# Altium schematic sheet Sheet1.SchDoc
size 420 x 297 mm; SheetNumber: 1; SheetTotal: 1
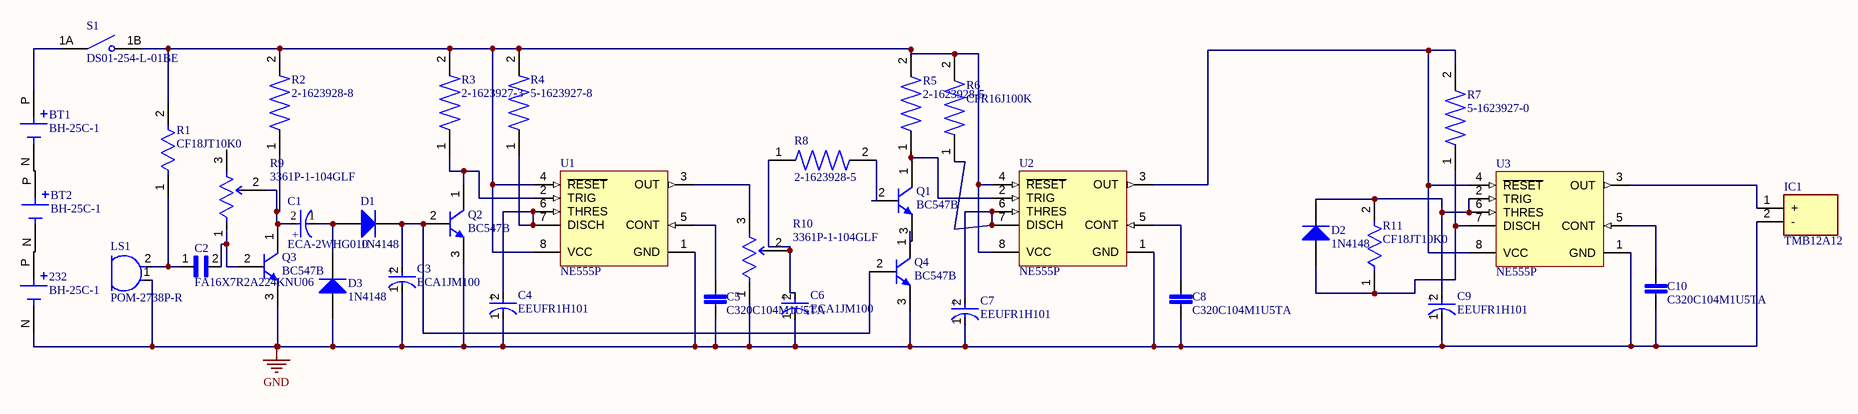
[diagram p0: Sheet1.SchDoc]

## Parts
232  BH-25C-1  [BAT_BH-25C-1]
BT1  BH-25C-1  [BAT_BH-25C-1]
BT2  BH-25C-1  [BAT_BH-25C-1]
C1  ECA-2WHG010  [FP-ECA-2WHG010-MFG]
C2  FA16X7R2A224KNU06  [CAPRB250W50L550T350H600]
C3  ECA1JM100  [FP-RAD-TH-D_5_0_5-L_11_1-MFG]
C4  EEUFR1H101  [FP-RAD-TH-D_8_0_5-L_11_5-MFG]
C5  C320C104M1U5TA  [LEADED_DECOUPLING_CAP(.1)]
C6  ECA1JM100  [FP-RAD-TH-D_5_0_5-L_11_1-MFG]
C7  EEUFR1H101  [FP-RAD-TH-D_8_0_5-L_11_5-MFG]
C8  C320C104M1U5TA  [LEADED_DECOUPLING_CAP(.1)]
C9  EEUFR1H101  [FP-RAD-TH-D_8_0_5-L_11_5-MFG]
C10  C320C104M1U5TA  [LEADED_DECOUPLING_CAP(.1)]
D1  1N4148  [NXP-SOD27-2_V]
D2  1N4148  [NXP-SOD27-2_V]
D3  1N4148  [NXP-SOD27-2_V]
IC1  TMB12A12  [TMB12A12]
LS1  POM-2738P-R  [FP-POM-2738P-R-MFG]
Q1  BC547B  [ONSC-TO-92-3-29-11]
Q2  BC547B  [ONSC-TO-92-3-29-11]
Q3  BC547B  [ONSC-TO-92-3-29-11]
Q4  BC547B  [ONSC-TO-92-3-29-11]
R1  CF18JT10K0  [FP-CF18-MFG]
R2  2-1623928-8  [RESAD700W45L350D185]
R3  2-1623927-3  [RESAD700W45L350D185]
R4  5-1623927-8  [RESAD700W45L350D185]
R5  2-1623928-5  [RESAD700W45L350D185]
R6  CFR16J100K  [RESAD700W45L350D185]
R7  5-1623927-0  [RESAD700W45L350D185]
R8  2-1623928-5  [RESAD700W45L350D185]
R9  3361P-1-104GLF  [FP-3361P-MFG]
R10  3361P-1-104GLF  [FP-3361P-MFG]
R11  CF18JT10K0  [FP-CF18-MFG]
S1  DS01-254-L-01BE  [SW_DS01-254-L-01BE]
U1  NE555P  [P0008A]
U2  NE555P  [P0008A]
U3  NE555P  [P0008A]

## Nets
GND: 232.N C3.1(C) C4.1(C) C5.2 C6.1(C) C7.1(C) C8.2 C9.1(C) C10.2 D3.1(A) IC1.2(-) LS1.1(A) Q2.3(E) Q3.3(E) Q4.3(E) R10.1(CCW) U1.1(GND) U2.1(GND) U3.1(GND)
Net232_P: 232.P BT2.N
NetBT1_N: BT1.N BT2.P
NetBT1_P: BT1.P S1.1A(COM1)
NetC1_1: C1.1(C) D1.1(A) D3.2(K)
NetC1_2: C1.2(A) Q3.1(C) R2.1 R9.2(WIPER)
NetC2_1: C2.1 LS1.2(C) R1.1
NetC2_2: C2.2 Q3.2(B) R9.1(CCW)
NetC3_2: C3.2(A) D1.2(K) Q2.2(B) Q4.2(B)
NetC4_2: C4.2(A) R4.1 U1.6(THRES) U1.7(DISCH)
NetC5_1: C5.1 U1.5(CONT)
NetC6_2: C6.2(A) R8.1 R10.2(WIPER)
NetC7_2: C7.2(A) R6.1 U2.6(THRES) U2.7(DISCH)
NetC8_1: C8.1 U2.5(CONT)
NetC9_2: C9.2(A) D2.2(K) R11.2 U3.2(TRIG) U3.6(THRES)
NetC10_1: C10.1 U3.5(CONT)
NetD2_1: D2.1(A) R7.1 R11.1 U3.7(DISCH)
NetIC1_1: IC1.1(+) U3.3(OUT)
NetQ1_1: Q1.1(C) R5.1 U2.2(TRIG)
NetQ1_2: Q1.2(B) R8.2
NetQ1_3: Q1.3(E) Q4.1(C)
NetQ2_1: Q2.1(C) R3.1 U1.2(TRIG)
NetR1_2: R1.2 R2.2 R3.2 R4.2 R5.2 R6.2 S1.1B(NO1) U1.4(~{RESET}) U1.8(VCC) U2.4(~{RESET}) U2.8(VCC)
NetR7_2: R7.2 U2.3(OUT) U3.4(~{RESET}) U3.8(VCC)
NetR10_3: R10.3(CW) U1.3(OUT)

Not connected (* = marked no-connect by the designer): R9 3(CW)

## Notes on the sheet
- THIS DOCUMENT AND THE DATA DISCLOSED HEREIN OR
- HEREWITH IS THE PROPERTY OF ALTIUM LIMITED AND MAY
- DWG NO:
- REVISION
- REV:
- DESCRIPTION
- DATE
- APPROVED
- BE FREELY DISTRIBUTED IN WHOLE. NO RIGHTS ARE
- RESERVED OR EXPRESS OR IMPLIED WARANTEE GIVEN.
- ENG:
- APPROVALS
- PROJECT
- DSN:
- CHK:
- REFERENCE DOCUMENTS
- PROJECT REVISION:
- TITLE
- DOCUMENT REVISION:
- DESIGN ITEM:
- BOM:
- FAB DWG:
- PCB DWG:
- ASSY DWG:
- SCALE:
- A3
- SIZE
- CAGE CODE
- FILE NAME
- DWG NO.
- SHEET
- OF
- REV
- (in symbol CMP-00287-55558411-1) +
- (in symbol CMP-05427-001517-1) +
- (in symbol CMP-05427-002079-1) +

## Library data of the parts
232 BT1 BT2 = BH-25C-1: Battery holder, coin, 20MM 1 CEL PC PIN | Adam Tech BH-25C-1; SnapEDA_Link: https://www.snapeda.com/parts/BH-25C-1/Adam+Tech/view-part/?ref=snap; Package: None; Value: *; MF: Adam Tech; MP: BH-25C-1; Check_prices: https://www.snapeda.com/parts/BH-25C-1/Adam+Tech/view-part/?ref=eda
C1 = CMP-00287-55558411-1: ECA-2WHG010 Aluminum Electrolytic Capacitor, 1 uF, 450 V, ± 20%, 2000 hours @ 105°C, Radial Leaded; Dielectric Material: Aluminium; Voltage Rating: 450V; Capacitance: 1µF; Dissipation Factor: 0.24%; Lead Diameter: 600µm; Ripple Current: 18mA; Lead/Base Style: Straight; Packaging: Bulk; Width: 8mm; Lead Pitch: 3.5mm; Termination: Radial; Contact Plating: Tin; Length: 11.5mm; Radiation Hardening: No; Voltage Rating (DC): 450V; Max Operating Temperature: 105°C; REACH SVHC: No SVHC; Min Operating Temperature: -25°C; Diameter: 8mm; RoHS: Compliant; Mount: PCB, Through Hole; Tolerance: 20%; Schedule B: 8532220020, 8532220020; Height: 11.5mm; Lead Free: Lead Free; Number of Pins: 2; Height - Seated (Max): 12.4968mm; Life (Hours): 2000hours; Voltage: 450V; Voltage Rating (AC): 450V; NexarPartId: 55558411; Case/Package: Radial
C2 = FA16X7R2A224KNU06: CAP CER 0.22UF 100V X7R RADIAL; MF: TDK; Purchase-URL: https://pricing.snapeda.com/search/part/FA16X7R2A224KNU06/?ref=eda; Value: *; Availability: In Stock; Package: Radial TDK; SnapEDA_Link: https://www.snapeda.com/parts/FA16X7R2A224KNU06/TDK/view-part/?ref=snap; MP: FA16X7R2A224KNU06; Check_prices: https://www.snapeda.com/parts/FA16X7R2A224KNU06/TDK/view-part/?ref=eda; Price: None
C3 C6 = CMP-05427-001517-1: Aluminum Electrolytic Capacitors (Radial Lead Type) 10uF ±20% 63V; Life (Hours): 2000Hour; Dielectric Material: Aluminium; Lead/Base Style: Straight; Ripple Current: 70mA; Dissipation Factor: 0.11%; Leakage Current: 3uA; Lead Diameter: 0.5mm; Max Operating Temperature: 85°C; Capacitance: 10uF; Voltage Rating: 63V; Packaging: Bulk; Radiation Hardening: No; Tolerance: 20%; Height: 11mm; Mount: Through Hole; Voltage: 63V; Voltage Rating (DC): 63V; Lead Pitch: 2mm; RoHS Compliant: Yes; Diameter: 5mm; Package Quantity: 200; Length: 11mm; Case/Package: Radial; Min Operating Temperature: -40°C; Construction: RADIAL; Height - Seated (Max): 0.472inch; Lead Free: Lead Free; Termination: Radial; Width: 5mm; Series: M; REACH SVHC: No SVHC
C4 C7 C9 = CMP-05427-002079-1: Aluminum Electrolytic Capacitors (Radial Lead Type) 100uF ±20% 50V; ESR (Equivalent Series Resistance): 61mR; Lead Diameter: 0.6mm; Ripple Current (AC): 870mA; Life (Hours): 6000Hour; Lead/Base Style: Straight; Height - Seated (Max): 0.512inch; Height: 11.5mm; REACH SVHC: No SVHC; Contact Plating: Tin; Impedance: 61mR; Capacitance: 100uF; Voltage: 50V; Termination: Radial; Series: FR; Voltage Rating: 50V; Lead Pitch: 3.5mm; Diameter: 8mm; Number of Pins: 2; Min Operating Temperature: -40°C; Mount: Through Hole; Ripple Current: 870mA; Radiation Hardening: No; Length: 11.5mm; Max Operating Temperature: 105°C; Construction: RADIAL; Packaging: Bulk; Package Quantity: 200; Case/Package: Radial; RoHS Compliant: Yes; Voltage Rating (DC): 50V; Tolerance: 20%
C5 C8 C10 = C320C104M1U5TA: 0.1ÂµF Â±20% 100V Ceramic Capacitor Z5U Radial; MF: KEMET; SnapEDA_Link: https://www.snapeda.com/parts/C320C104M1U5TA/KEMET/view-part/546418/?ref=snap; MP: C320C104M1U5TA; Price: None; Value: *; Availability: Unavailable; Package: Radial Kemet
D1-D3 = CMP-0648-00002-1: High-speed Diode, 100 V, 450 mA, 2-Pin SOD27, RoHS; Manufacturer: NXP Semiconductors; Configuration: Single; IR (VR: 20 V)=25 nA; IFRM: 450 mA; IFSM: 4 A Max.; Trr: 4 ns Max.; Cd: 4 pF Max.; VR: 100 V Max.; VF (IF: 10 mA)=1 V; IF: 200 mA Max.; ComponentLink1Description: Manufacturer URL; RoHS: TRUE; ComponentLink1URL: http://www.nxp.com/; ComponentLink3Description: Package Specification; DatasheetVersion: Aug-04; ComponentLink2Description: Datasheet; PackageVersion: Aug-04; PackageReference: SOD27; ComponentLink3URL: http://www.nxp.com/documents/data_sheet/1N4148_1N4448.pdf; Mounting Technology: Through Hole; ComponentLink2URL: http://www.nxp.com/documents/data_sheet/1N4148_1N4448.pdf; PartNumber: 1N4148; PackageDescription: 2-Pin Hermetically Sealed Glass Package, Axial Leaded, Dia 1.85 mm, Body Length 4.25 mm, Lead Spread 25.4 mm
IC1 = TMB12A12: Integrated Circuit; Manufacturer_Name: Jiangsu Huaneng Elec; Datasheet Link: https://datasheet.lcsc.com/szlcsc/Jiangsu-Huaneng-Elec-TMB12A12_C96079.pdf; Height: 9.8mm; Manufacturer_Part_Number: TMB12A12
LS1 = CMP-103887-000001-1: MIC COND ANALOG OMNI -38DB; Manufacturer: PUI Audio, Inc.; Current: 0.5mA; Direction: Omidirectional; Value: 2.2kΩ; Operating Supply Voltage: 2V; Max Supply Voltage: 10V; Package: 0; Device Class L3: Microphones; Device Class L2: Audio Products; Octopart: https://octopart.com/pom-2738p-r-pui+audio-19251807; Manufacturer Part Number: POM-2738P-R; Height: 2.9mm; Mouser Description: Mic Omni-Directional 2200Ohm -38±3dB 10Vdc Round Pin; Lead Free: Yes; Automotive: No; RoHS: TRUE; ComponentLink2Description: Datasheet; Category: Speak; Device Class L1: Electromechanical; Digikey Description: MIC COND ANALOG OMNI -38DB; ComponentLink2URL: http://www.puiaudio.com/pdf/POM-2738P-R.pdf; Resistance: 2.2kΩ
Q1-Q4 = CMP-1048-01467-1: Amplifier Transistor, NPN Silicon, 3-Pin TO-92, Bulk Box; Manufacturer: On Semiconductor; IC Continuous (A): 0.1; fT Min (MHz): 150; DatasheetVersion: Rev. 7; ComponentLink1URL: http://www.onsemi.com/; Polarity: NPN; RoHS: FALSE; ComponentLink1Description: Manufacturer URL; Packing: Bulk Box; PackageDescription: 3-Pin Transistor Outline, Body 4.825 x 3.685 mm, Pitch 1.27 mm; ComponentLink3URL: http://www.onsemi.cn/pub_link/Collateral/2N6426-D.PDF; ComponentLink2Description: Datasheet; PackageVersion: Rev. AM; PackageReference: TO-92-3-29-11_AM_SL; ComponentLink3Description: Package Specification; Mounting Technology: Through Hole; PartNumber: BC547B; ComponentLink2URL: http://www.onsemi.com/pub_link/Collateral/BC546-D.PDF
R1 R11 = CMP-26528-000002-1: RES 10K OHM 1/8W 5% CF AXIAL; Manufacturer: Stackpole Electronics; Power Rating: 0.125W; Temperature Coefficient: 0-500ppm/°C; Resistance: 10kΩ; Voltage Rating: 250V; Value: 10kΩ; Description: RES 10K OHM 1/8W 5% AXIAL; Temperature: -55°C to +155°C; Height: 2mm; Lead Free: Yes; Automotive: No; Device Class L2: Resistors; Package: CF18; Series: CF; ComponentLink2Description: Datasheet; Ipc Land Pattern Name: RESAD656W65L360D200; Manufacturer Part Number: CF18JT10K0; Temperature Range High: +155°C; RoHS: TRUE; Device Class L3: Through-Hole Resistors; Temperature Range Low: -55°C; Device Class L1: Passive Components; Category: Res; Octopart: https://octopart.com/cf18jt10k0-stackpole+electronics-19205642; Composition: Carbon Film; Digikey Description: RES 10K OHM 1/8W 5% CF AXIAL; ComponentLink2URL: http://www.seielect.com/Catalog/SEI-CF_CFM.pdf; Tolerance: 5%
R2 = 2-1623928-8: CFR16 5% 10K; Price: None; MP: 2-1623928-8; Availability: Unavailable; Value: *; Package: None
R3 = 2-1623927-3: Carbon Film Resistors - Through Hole 1K Ohm 5% 1/4W Res Carbon Film; Voltage_Rating: 200 V; MF: TE Connectivity; Power_Rating: .25 W; Value: *; Tolerance: 5%; SnapEDA_Link: https://www.snapeda.com/parts/2-1623927-3/TE+Connectivity/view-part/?ref=snap; Resistance: 1K; Purchase-URL: https://pricing.snapeda.com/search/part/2-1623927-3/?ref=eda; EU_RoHS_Compliance: Compliant; Availability: In Stock; Price: None; Package: None; Check_prices: https://www.snapeda.com/parts/2-1623927-3/TE+Connectivity/view-part/?ref=eda; MP: 2-1623927-3
R4 = 5-1623927-8: CFR16 5% 10K; Package: None; Price: None; Value: *; MP: 5-1623927-8; Availability: Unavailable
R5 R8 = 2-1623928-5: 470 Ohms Â±5% 0.25W, 1/4W Through Hole Resistor Axial - Carbon Film; Tolerance: 5%; Resistance: 470; Voltage_Rating: 200 V; MF: TE Connectivity; Power_Rating: .25 W; Value: *; SnapEDA_Link: https://www.snapeda.com/parts/2-1623928-5/TE+Connectivity/view-part/?ref=snap; EU_RoHS_Compliance: Compliant; Availability: In Stock; Price: None; Package: None; Check_prices: https://www.snapeda.com/parts/2-1623928-5/TE+Connectivity/view-part/?ref=eda; MP: 2-1623928-5
R6 = CFR16J100K: 100 kOhms Â±5% 0.25W, 1/4W Through Hole Resistor Axial - Carbon Film; MF: TE Connectivity Passive Product; Price: None; Value: *; Purchase-URL: https://pricing.snapeda.com/search/part/CFR16J100K/?ref=eda; Check_prices: https://www.snapeda.com/parts/CFR16J100K/TE+Connectivity/view-part/?ref=eda; Package: None; Availability: In Stock; SnapEDA_Link: https://www.snapeda.com/parts/CFR16J100K/TE+Connectivity/view-part/?ref=snap; MP: CFR16J100K
R7 = 5-1623927-0: CFR16 5% 10K; Package: None; Price: None; Value: *; MP: 5-1623927-0; Availability: Unavailable
R9 R10 = CMP-07234-000051-1: TRIMMER 100K OHM 0.5W GW TOP ADJ; Resistance: 100kR; Power Rating: 500mW; Temperature Coefficient: 100ppm/°C; Resistance Tolerance: 10%; Voltage Rating: 300V; Number of Turns: 1; Resistor Type: Cermet; Package Quantity: 1; Depth: 8.53mm; Packaging: Tape and Reel; Max Operating Temperature: 125°C; Height: 0.192inch; Length: 6.71mm; Termination: Gull Wing; Weight: 0.02oz; Radiation Hardening: No; Mount: Surface Mount; Color: Natural; Lead Free: Lead Free; Max Power Dissipation: 500mW; Series: Trimpot® 3361 - Sealed; Military Standard: Not; Tolerance: 10%; REACH SVHC: No SVHC; RoHS Compliant: Yes; Taper: Linear; Min Operating Temperature: -55°C; Technology: CERMET; Voltage Rating (DC): 300V; Width: 0.264inch
S1 = DS01-254-L-01BE: 1 Position, Through Hole, 2.54 mm Pitch, Raised Slide Actuator, Flat Bottom, Long Pin, DIP Switch; MF: CUI Devices; Check_prices: https://www.snapeda.com/parts/DS01-254-L-01BE/CUI+Devices/view-part/?ref=eda; CUI_purchase_URL: https://www.cuidevices.com/product/switches/dip-switches/ds01-254-series?utm_source=snapeda.com&utm_medium=referral&utm_campaign=snapedaBOM; Package: None; Purchase-URL: https://pricing.snapeda.com/search/part/DS01-254-L-01BE/?ref=eda; MP: DS01-254-L-01BE; Value: *; SnapEDA_Link: https://www.snapeda.com/parts/DS01-254-L-01BE/CUI+Devices/view-part/?ref=snap; Availability: In Stock; Price: None
U1-U3 = CMP-2000-04954-1: Precision Timer, 4.5 to 16 V, 0 to 70 degC, 8-Pin DIP, Pb-Free, Tube; Manufacturer: TexasInstruments; Maximum High Level Output Current: -200mA; Number of Internal Timers: 1; Operating Supply Voltage: 5; Maximum Low Level Output Current: 200mA; Rad Hard: No; Packaging: Rail/Tube; Manufacturer URL: http://www.ti.com/; Package Reference: P8; Package Description: 8-Pin Double In-line Package, Body 9.59 x 6.35 mm, Pitch 2.54 mm; Package URL: http://www.ti.com/lit/ml/mpdi001b/mpdi001b.pdf; Type: Standard; Datasheet URL: http://www.ti.com/general/docs/lit/getliterature.tsp?genericPartNumber=NE555&fileType=pdf; Category: Timer; Package: 8PDIP; Datasheet Version: Rev. I, 09/2014